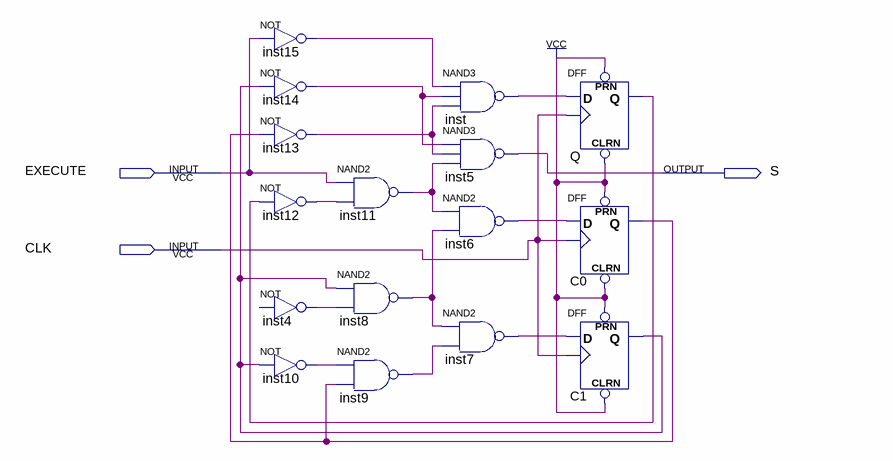
[diagram p0: schematic sheet]
// Quartus schematic Control.bdf as structural Verilog: 16 symbols, 3 pins
module Control (
  input  EXECUTE,
  input  CLK,
  output S
);

  wire C0_q, C1_q, inst4_out, inst6_out, inst7_out, inst8_out, inst9_out, inst10_out, inst11_out, inst12_out,
       inst13_out, inst14_out, inst15_out, inst_out, Q_q;

  not inst15 (inst15_out, EXECUTE);
  not inst14 (inst14_out, C1_q);
  not inst13 (inst13_out, C0_q);
  not inst12 (inst12_out, Q_q);
  // NOT inst4 has open pins: IN=open, OUT=inst4_out
  not inst10 (inst10_out, C1_q);
  nand inst11 (inst11_out, EXECUTE, inst12_out);
  nand inst8 (inst8_out, C1_q, inst4_out);
  nand inst9 (inst9_out, inst10_out, C0_q);
  nand inst (inst_out, inst15_out, inst14_out, inst13_out);
  nand inst5 (S, inst14_out, inst13_out, inst11_out);
  nand inst6 (inst6_out, inst11_out, inst8_out);
  nand inst7 (inst7_out, inst8_out, inst9_out);
  DFF Q (.CLRN(1'b1), .CLK(CLK), .D(inst_out), .PRN(1'b1), .Q(Q_q));
  DFF C0 (.CLRN(1'b1), .CLK(CLK), .D(inst6_out), .PRN(1'b1), .Q(C0_q));
  DFF C1 (.CLRN(1'b1), .CLK(CLK), .D(inst7_out), .PRN(1'b1), .Q(C1_q));
endmodule
